# EAGLE design untitled (EAGLE 6.4)
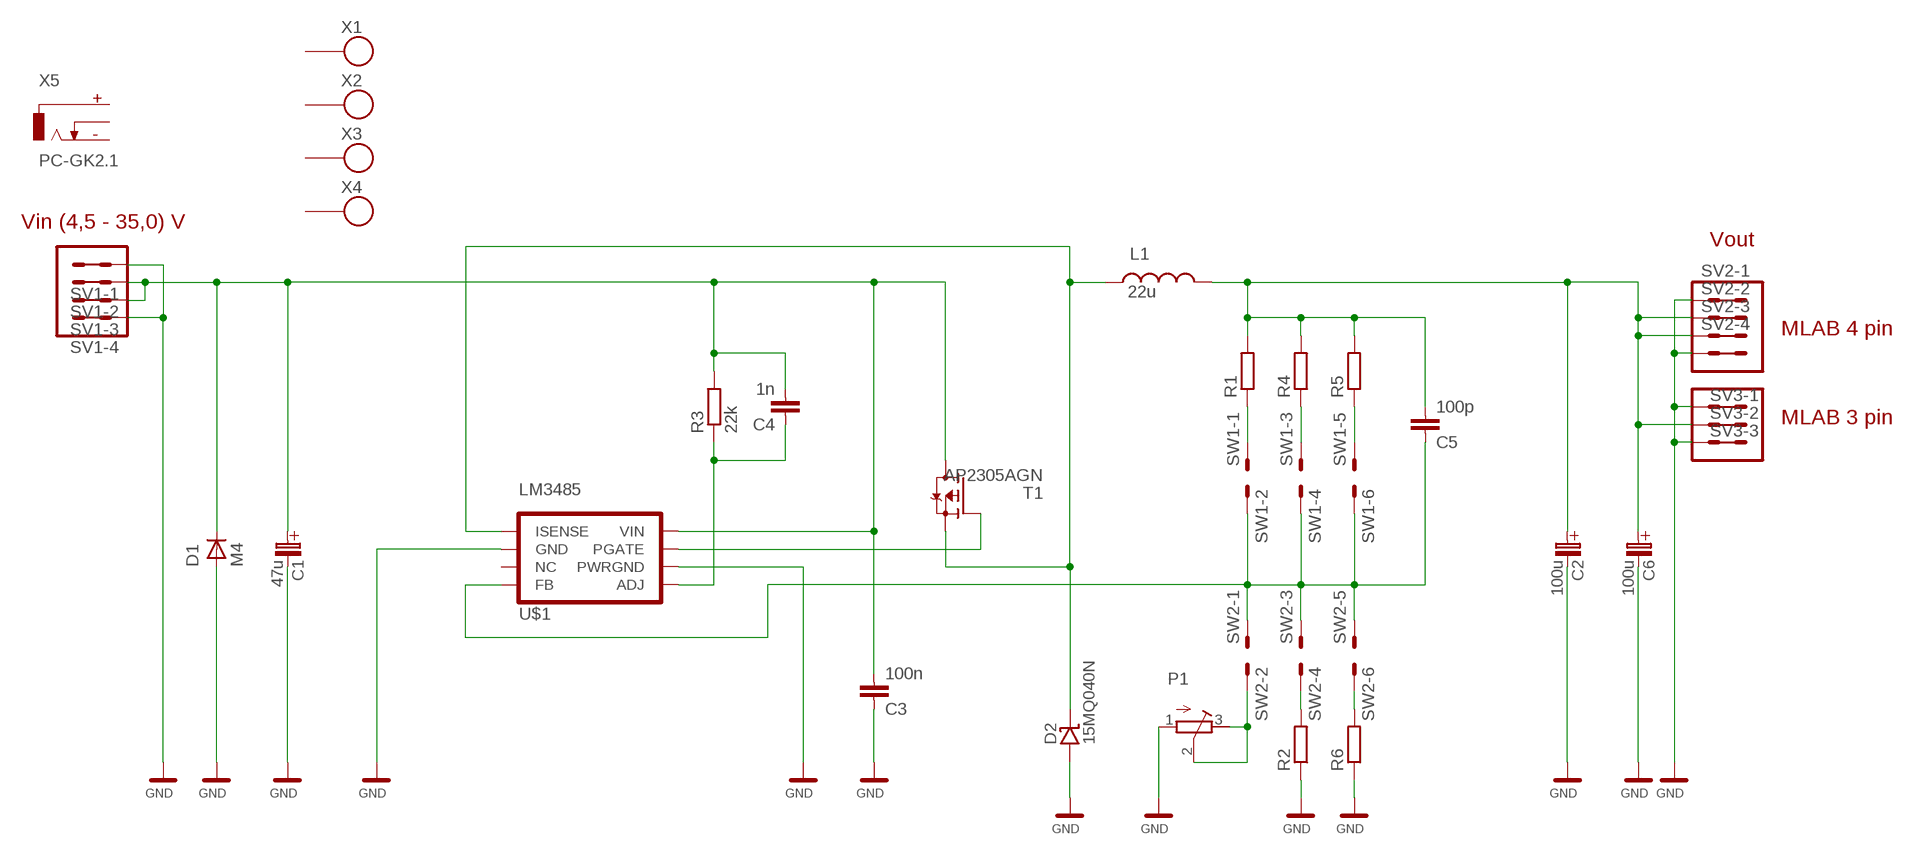
[diagram p0: schematic, sheet 1]

## Parts
C1  47u  C  [C]
C2  100u  C  [C]
C3  100n  C0805  [C0805]
C4  1n  C0805  [C0805]
C5  100p  C0805  [C0805]
C6  100u  C  [C]
D1  M4  D-OB.SMA  [SMA]
D2  15MQ040N  D-SHOTKY-SMA  [SMA]
L1  22u  DE1205-10  [DE1205-10]
P1  TRIMR_CA6XV  [TRIM_CA6XV]
R1  R0805  [0805]
R2  R0805  [0805]
R3  22k  R0805  [0805]
R4  R0805  [0805]
R5  R0805  [0805]
R6  R0805  [0805]
SV1  MA04-2  [MA04-2]
SV2  MA04-2  [MA04-2]
SV3  MA03-2  [MA03-2]
SW1  MA03-3  [MA03-2]
SW2  MA03-3  [MA03-2]
T1  AP2305AGN  [SOT23]
U$1  LM3485  [MSOP-8]
X1  SROUB3M  [SROUB3M]
X2  SROUB3M  [SROUB3M]
X3  SROUB3M  [SROUB3M]
X4  SROUB3M  [SROUB3M]
X5  DC2.1MM  [DC2.1MM]

## Nets
GND: C1.-(C_EL-) C2.-(C_EL-) C3.1 C6.-(C_EL-) D1.A D2.A P1.1 R2.1 R6.1 SV1.1 SV1.2 SV1.7 SV1.8 SV2.1 SV2.2 SV2.7 SV2.8 SV3.1 SV3.2 SV3.5 SV3.6 U$1.2(GND) U$1.6(PWRGND)
N$1: T1.1(G) U$1.7(PGATE)
N$2: C1.+(C_EL+) C3.2 C4.2 D1.K(C) R3.2 SV1.3 SV1.4 SV1.5 SV1.6 T1.3(D) U$1.8(VIN)
N$3: C5.1 SW1.2 SW1.4 SW1.6 SW2.1 SW2.3 SW2.5 U$1.4(FB)
N$4: C4.1 R3.1 U$1.5(ADJ)
N$5: R1.1 SW1.1
N$6: D2.K L1.P$1 T1.2(S) U$1.1(ISENSE)
N$7: R4.1 SW1.3
N$8: C2.+(C_EL+) C5.2 C6.+(C_EL+) L1.P$2 R1.2 R4.2 R5.2 SV2.3 SV2.4 SV2.5 SV2.6 SV3.3 SV3.4
N$9: R5.1 SW1.5
N$10: R2.2 SW2.4
N$11: R6.2 SW2.6
N$12: P1.2 P1.3 SW2.2
Unconnected: U$1.3(NC) X1.P$1 X2.P$1 X3.P$1 X4.P$1 X5.+ X5.GND(-) X5.SW

## Notes on the sheet
- Vin (4,5 - 35,0) V
- Vout
- MLAB 4 pin
- MLAB 3 pin

## Library data of the parts
C1 C2 C6 = moje_C:C
C3-C5 = moje_C:C0805
D1 = moje:D-OB.SMA: SMA
D2 = moje_diody:D-SHOTKY-SMA
L1 = moje_L:DE1205-10: tlumivka
P1 = moje_pot:TRIMR_CA6XV
R1-R6 = moje_R:R0805
SV1 SV2 = moje_hrebinky:MA04-2: PIN HEADER; OC_FARNELL: unknown; OC_NEWARK: unknown
SV3 = moje_hrebinky:MA03-2: PIN HEADER; OC_FARNELL: unknown; OC_NEWARK: unknown
SW1 SW2 = moje_hrebinky:MA03-3
T1 = moje_T:AP2305AGN
U$1 = ciza_io:LM3485
X1-X4 = moje:SROUB3M
X5 = moje_konektory:DC2.1MM

## Board
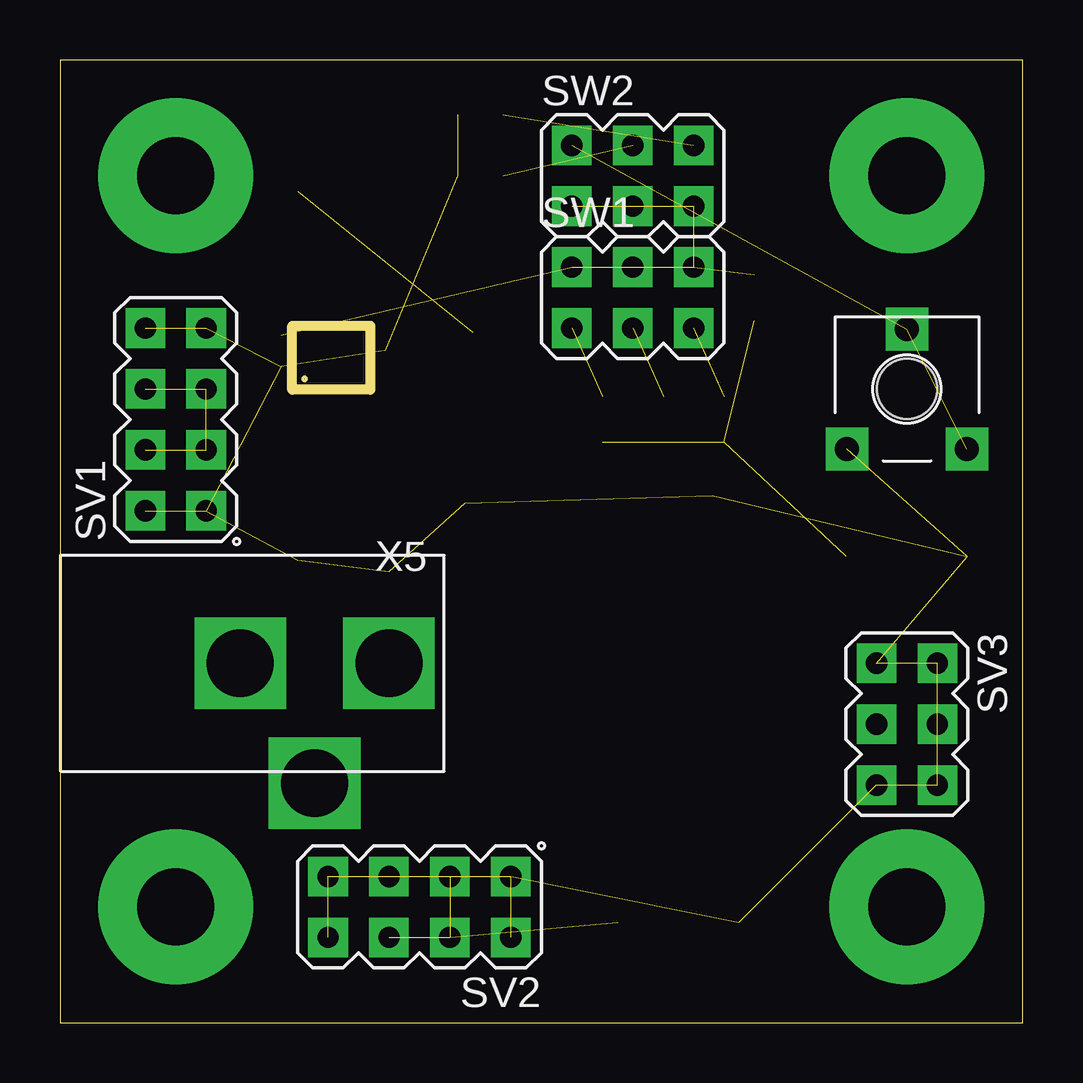
[diagram p1: board, top side]
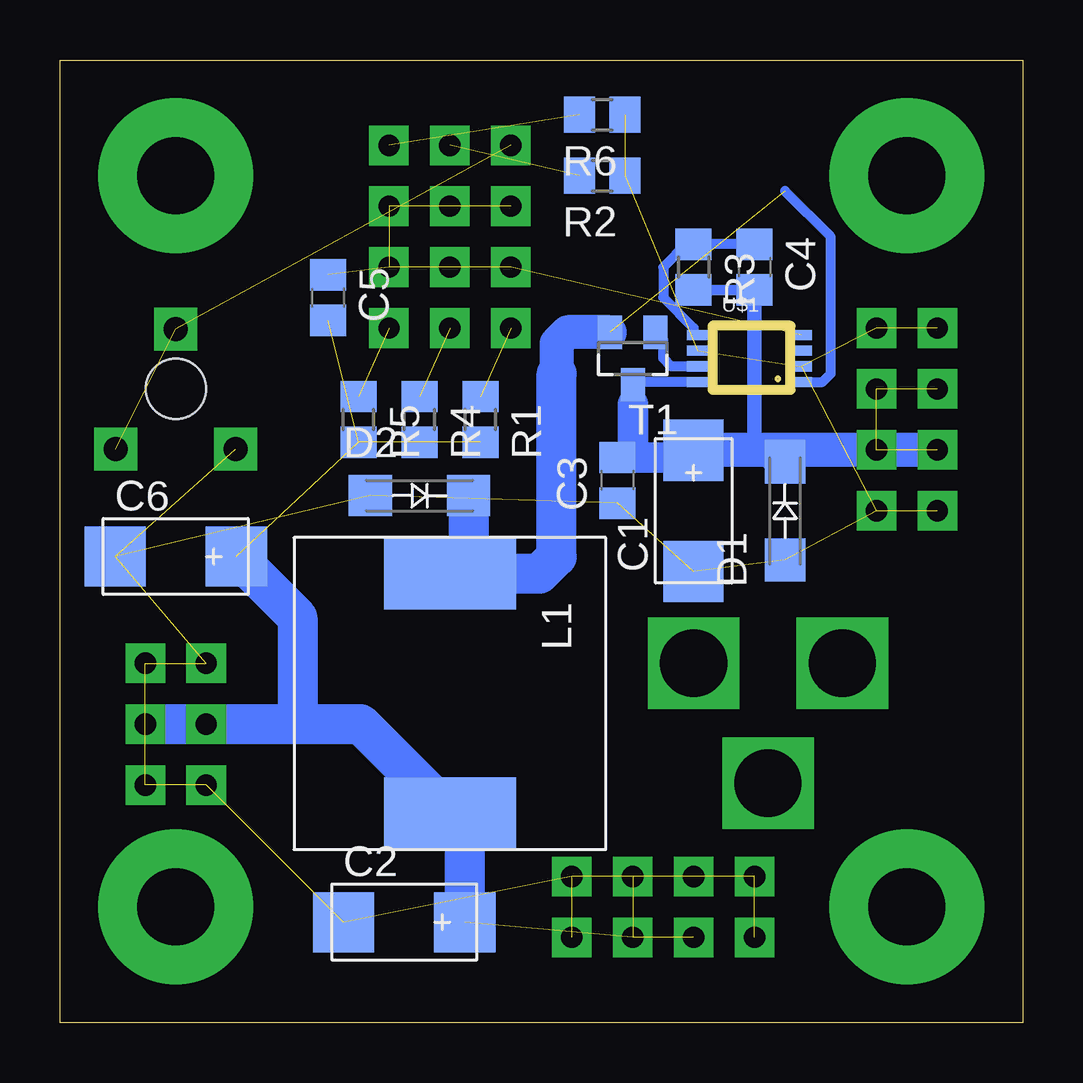
[diagram p2: board, bottom side, seen from below]

Size 40.13 x 40.13 mm. Coordinates in mm from the lower left corner, seen from the top.
Outline: 0,0 40.13,0 40.13,40.13 0,40.13 0,0
Copper layers (1*16): Top 0.035mm / dielectric 1.5mm / Bottom 0.035mm
Design rules "default": minimum track width 10mil, minimum drill 24mil, track to track 8mil, track to pad 8mil, pad to pad 8mil, via to via 8mil, smd to smd 8mil, copper to edge 40mil, drill to drill 8mil, minimum pad ring 10mil, minimum via ring 8mil, stop-mask expansion 4mil, vias tented up to drill 0mil, thermal gap 10mil

### Footprints (pad centres in the part's own frame; a part is rotated, then mirrored left to right if it is on the bottom)
C = smd 2.55 x 2.5: + 2.525,0; - -2.525,0
C0805 = smd 1.3 x 1.5: 1 -0.95,0; 2 0.95,0
SMA = smd 1.8 x 1.7: A -2.05,0; K 2.05,0
DE1205-10 = smd 3 x 5.5: P$1 -5,0; P$2 5,0
TRIM_CA6XV = drill 1 pad 1.778 square: 1 -2.5,-2.5; 2 0,2.5; 3 2.5,-2.5 | hole 2.5: 0,0
0805 = smd 1.3 x 1.5: 1 -0.95,0; 2 0.95,0
MA04-2 = drill 0.889 pad 1.651 square: 1 -3.81,-1.27; 2 -3.81,1.27; 3 -1.27,-1.27; 4 -1.27,1.27; 5 1.27,-1.27; 6 1.27,1.27; 7 3.81,-1.27; 8 3.81,1.27
MA03-2 = drill 0.889 pad 1.651 square: 1 -2.54,-1.27; 2 -2.54,1.27; 3 0,-1.27; 4 0,1.27; 5 2.54,-1.27; 6 2.54,1.27
SOT23 = smd 1 x 1.4: 1 -0.95,-1.1; 2 0.95,-1.1; 3 0,1.1
MSOP-8 = smd 0.42 x 0.89: 1 -0.975,-1.95; 2 -0.325,-1.95; 3 0.325,-1.95; 4 0.975,-1.95; 5 0.975,2.375; 6 0.325,2.375; 7 -0.325,2.375; 8 -0.975,2.375
SROUB3M = drill 3.2 pad 6.452: P$1 0,0
DC2.1MM = drill 2.8 square: + -3.81,0; GND 2.39,0; SW -0.71,5

### Placement (x,y rotation side)
C1  13.72,21.34 90 bottom
C2  25.78,4.19 0 bottom
C3  16.89,22.61 90 bottom
C4  11.18,31.5 270 bottom
C5  28.96,30.23 270 bottom
C6  35.31,19.43 0 bottom
D1  9.91,21.34 90 bottom
D2  25.15,21.97 0 bottom
L1  23.88,13.72 270 bottom
P1  35.31,26.42 0 top
R1  22.61,25.15 270 bottom
R2  17.53,35.31 180 bottom
R3  13.72,31.5 270 bottom
R4  25.15,25.15 270 bottom
R5  27.69,25.15 270 bottom
R6  17.53,37.85 180 bottom
SV1  4.83,25.15 90 top
SV2  14.99,4.83 180 top
SV3  35.31,12.45 270 top
SW1  23.88,30.23 0 top
SW2  23.88,35.31 0 top
T1  16.26,27.69 180 bottom
U$1  11.18,27.69 90 bottom
X1  4.83,4.83 0 top
X2  35.31,4.83 0 top
X3  4.83,35.31 0 top
X4  35.31,35.31 0 top
X5  9.91,14.99 180 top

### Tracks (layer width: path | path; a pad name or v marks a point on that pad's centre or on a via)
GND  (22 unrouted)
N$1
  Bottom 0.406: U$1.7 14.66,27.36 14.99,27.69 14.99,28.47 T1.1
N$2  (3 unrouted)
  Bottom 0.406: C4.2 R3.2 11.5,30.55 11.18,30.23 | U$1.8 16.13,26.71 T1.3
  Bottom 0.61: 11.18,30.23 11.18,23.88
  Bottom 1.016: T1.3 16.26,25.78
  Bottom 1.27: C3.2 16.26,23.56 | 16.26,23.56 14.02,23.56 C1.+ | 16.26,25.78 16.26,23.56
  Bottom 1.422: SV1.4 10.54,23.88 | 10.54,23.88 11.18,23.88 13.7,23.88 C1.+ | D1.K 10.05,23.39 10.54,23.88
N$3  (7 unrouted)
N$4
  Bottom 0.406: C4.1 R3.1 14.04,32.45 14.99,31.5 14.99,30.23 13.72,28.96 13.72,28.83 U$1.5
N$5  (1 unrouted)
N$6  (1 unrouted)
  Bottom 0.406: U$1.1 8.34,26.71 8,27.05 8,32.77 9.91,34.67
  Bottom 1.422: T1.2 18.97,28.79 19.43,28.32 19.43,27.05
  Bottom 1.676: L1.P$1 23.24,18.72 | 23.24,18.72 20.15,18.72 19.43,19.43 19.43,27.05 | D2.K 23.1,18.86 23.24,18.72
N$7  (1 unrouted)
N$8  (8 unrouted)
  Bottom 1.676: C2.+ 23.26,8.1 L1.P$2 27.61,12.45 30.23,12.45 | SV3.4 SV3.3 30.23,12.45 | C6.+ 32.77,19.43 30.23,16.89 30.23,12.45
N$9  (1 unrouted)
N$10  (1 unrouted)
N$11  (1 unrouted)
N$12  (2 unrouted)